# EAGLE design PCB1M1A2 (EAGLE 6.2)
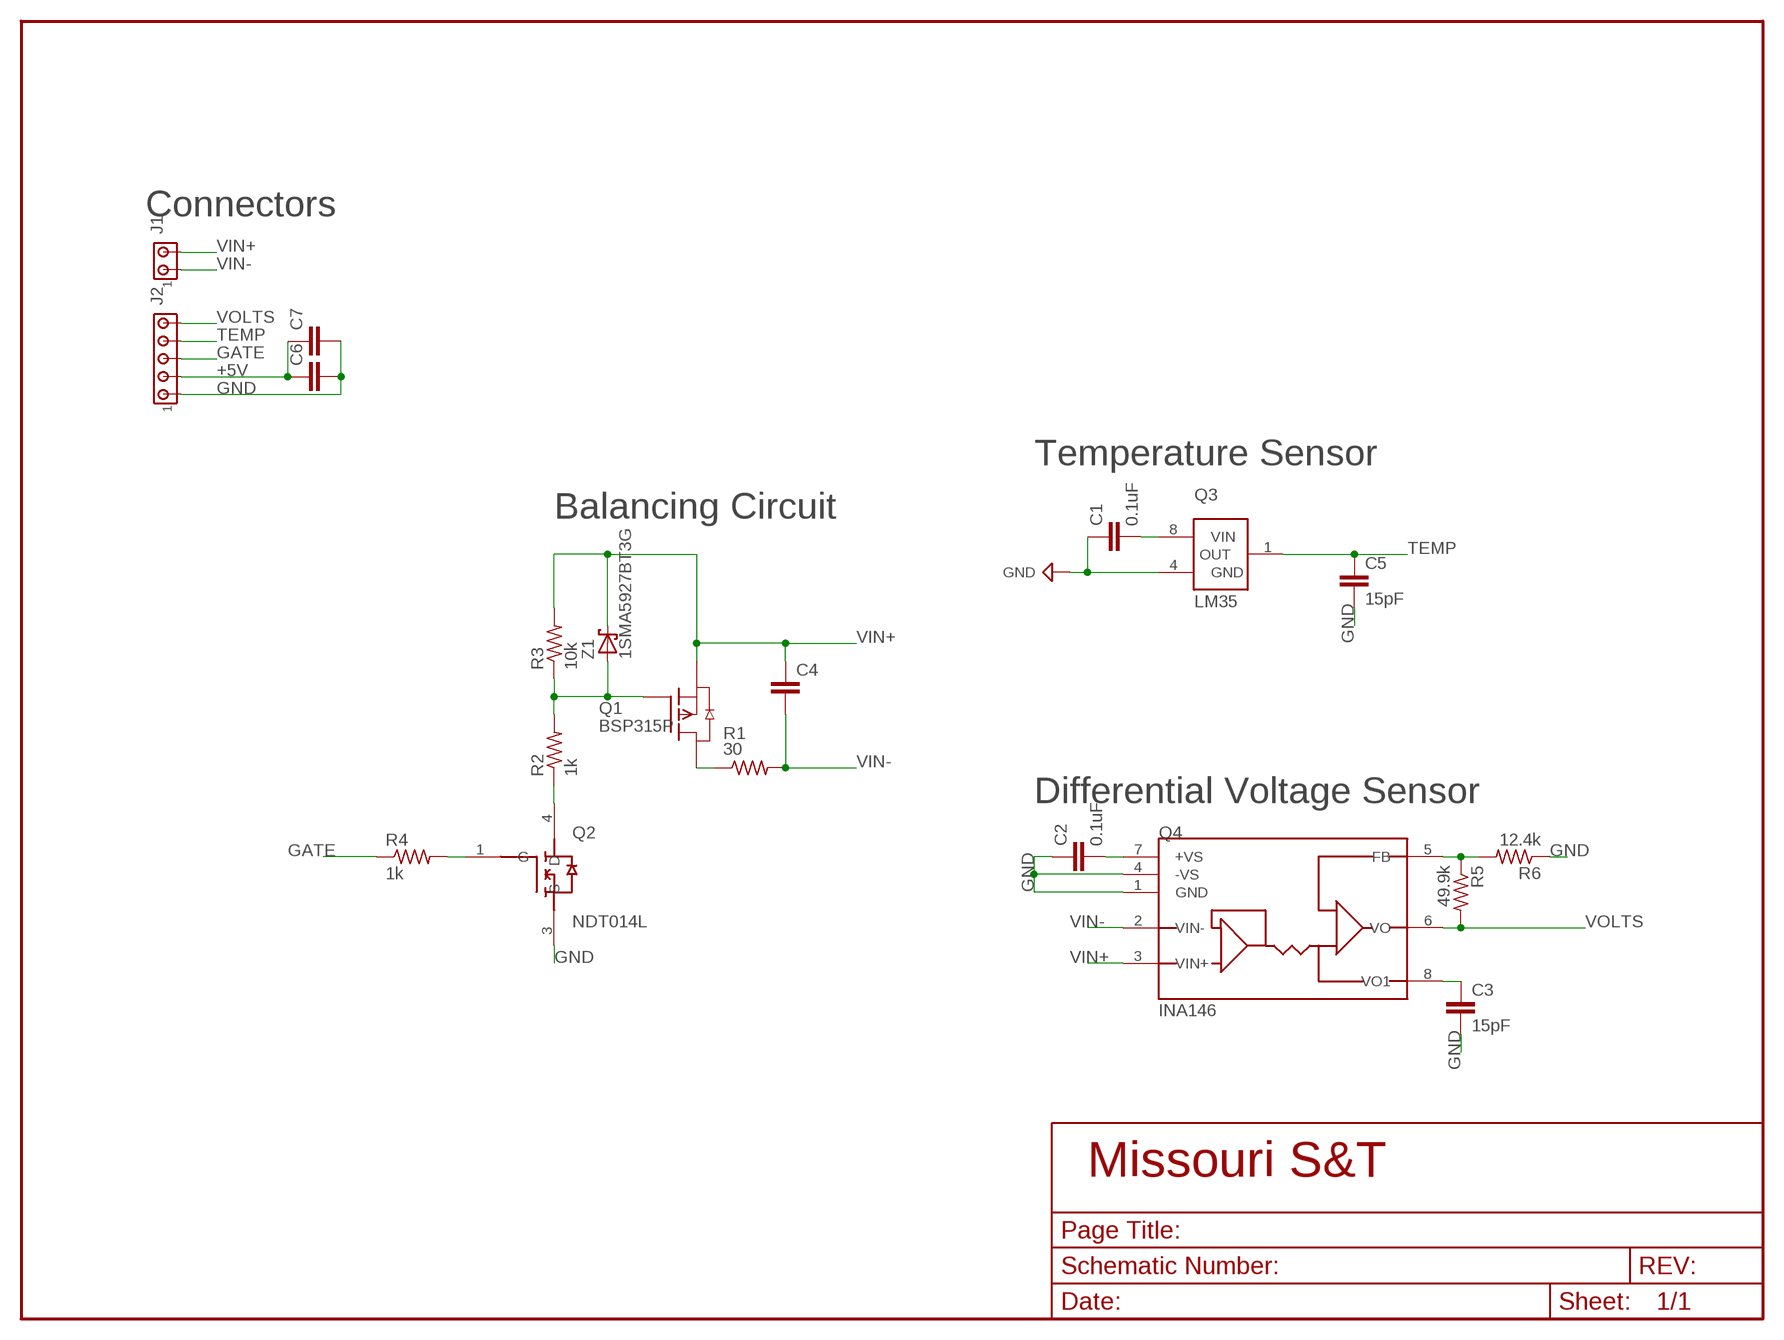
[diagram p0: schematic, sheet 1]

## Parts
C1  0.1uF  C_CAP_1206  [C_1206]
C2  0.1uF  C_CAP_1206  [C_1206]
C3  15pF  C_CAP_1206  [C_1206]
C4  C_CAP_1206  [C_1206]
C5  15pF  C_CAP_1206  [C_1206]
C6  C_CAP_1206  [C_1206]
C7  C_CAP_1206  [C_1206]
J1  J_MTA2P_100  [J_MTA100_2P]
J2  J_MTA5P_100  [J_MTA100_5P]
Q1  BSP315P  Q_BSP315P  [SOT-223]
Q2  NDT014L  Q_NDT014L  [SOT-223]
Q3  LM35  Q_LM35SOIC8  [SOIC8]
Q4  INA146  Q_INA146  [SOIC8]
R1  30  R_2512  [R_2512]
R2  1k  R_RES_1206  [R_1206]
R3  10k  R_RES_1206  [R_1206]
R4  1k  R_RES_1206  [R_1206]
R5  49.9k  R_RES_1206  [R_1206]
R6  12.4k  R_RES_1206  [R_1206]
Z1  1SMA5927BT3G  D_SSA34-E3/61T  [D_DO214AC]

## Nets
+5V: C1.2 C2.2 C6.1 C7.1 J2.2 Q3.8(VIN) Q4.7(+VS)
GATE: J2.3 R4.1
GND: C1.1 C2.1 C3.2 C5.2 C6.2 C7.2 J2.1 Q2.3(S) Q3.4(GND) Q4.1(GND) Q4.4(-VS) R6.1 ; supply symbol labelled SUP_GND
N$1: Q1.2(D) R1.P$1
N$7: Q2.4(D) R2.1
N$9: Q2.1(G) R4.2
N$13: Q4.5(FB) R5.1 R6.2
N$14: C3.1 Q4.8(VO1)
TEMP: C5.1 J2.4 Q3.1(OUT)
VIN+: C4.1 J1.2 Q1.3(S) Q4.3(VIN+) R3.2 Z1.C
VIN-: C4.2 J1.1 Q4.2(VIN-) R1.P$2
VOLTS: J2.5 Q4.6(VO) R5.2
Z1: Q1.1(G) R2.2 R3.1 Z1.A

## Notes on the sheet
- Connectors
- Temperature Sensor
- Balancing Circuit
- Differential Voltage Sensor

## Library data of the parts
C1-C7 = Lib_Passive:C_CAP
J1 = Lib_TH:J_MTA2P
J2 = Lib_TH:J_MTA5P
Q1 = PCB0M1:Q_BSP315P
Q2 = PCB0M1:Q_NDT014L
Q3 = PCB0M1:Q_LM35: IC, TEMPERATURE SENSOR, 0.4°C, TO-92-3
Q4 = PCB0M1:Q_INA146: High Voltage Differential Amplifier
R1 = PCB0M1:R_2512
R2-R6 = Lib_Passive:R_RES
Z1 = EE371:D_SSA34-E3/61T: SCHOTTKY RECTIFIER, 3A 40V DO-214AC

## Board
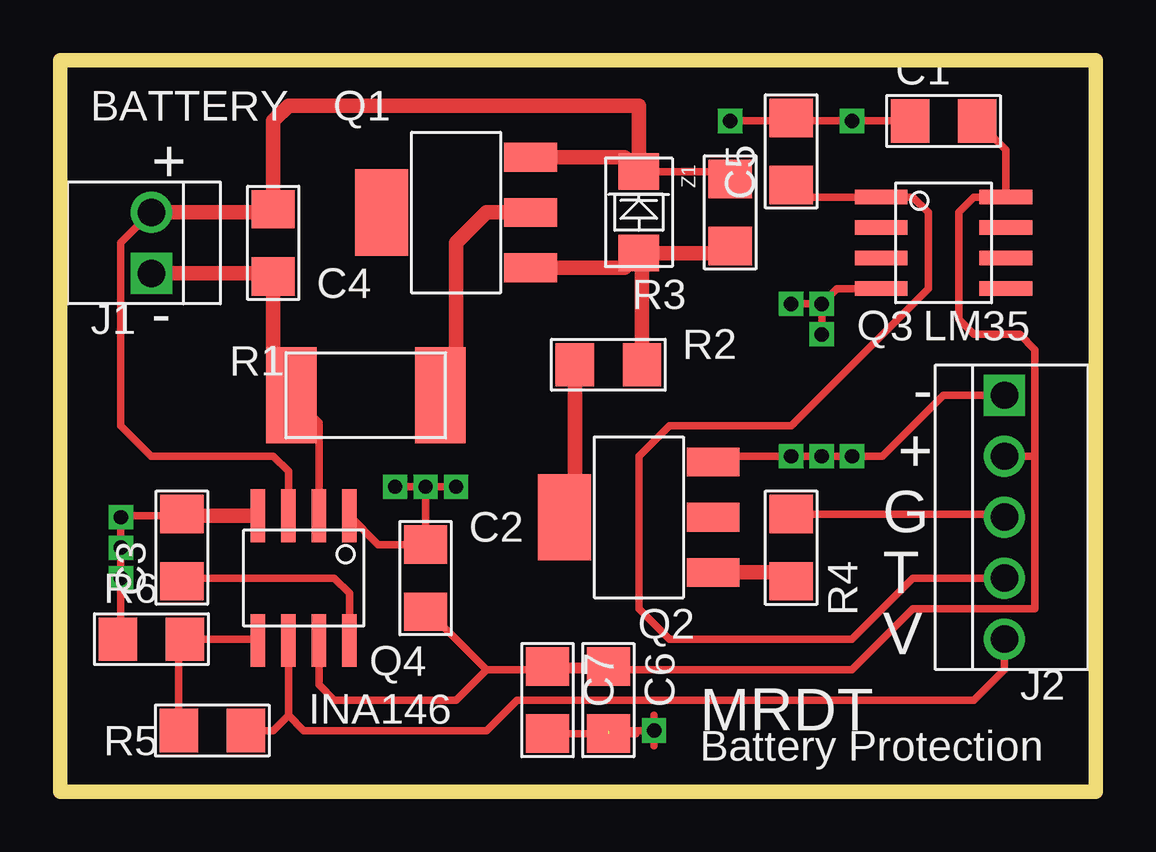
[diagram p1: board, top side]
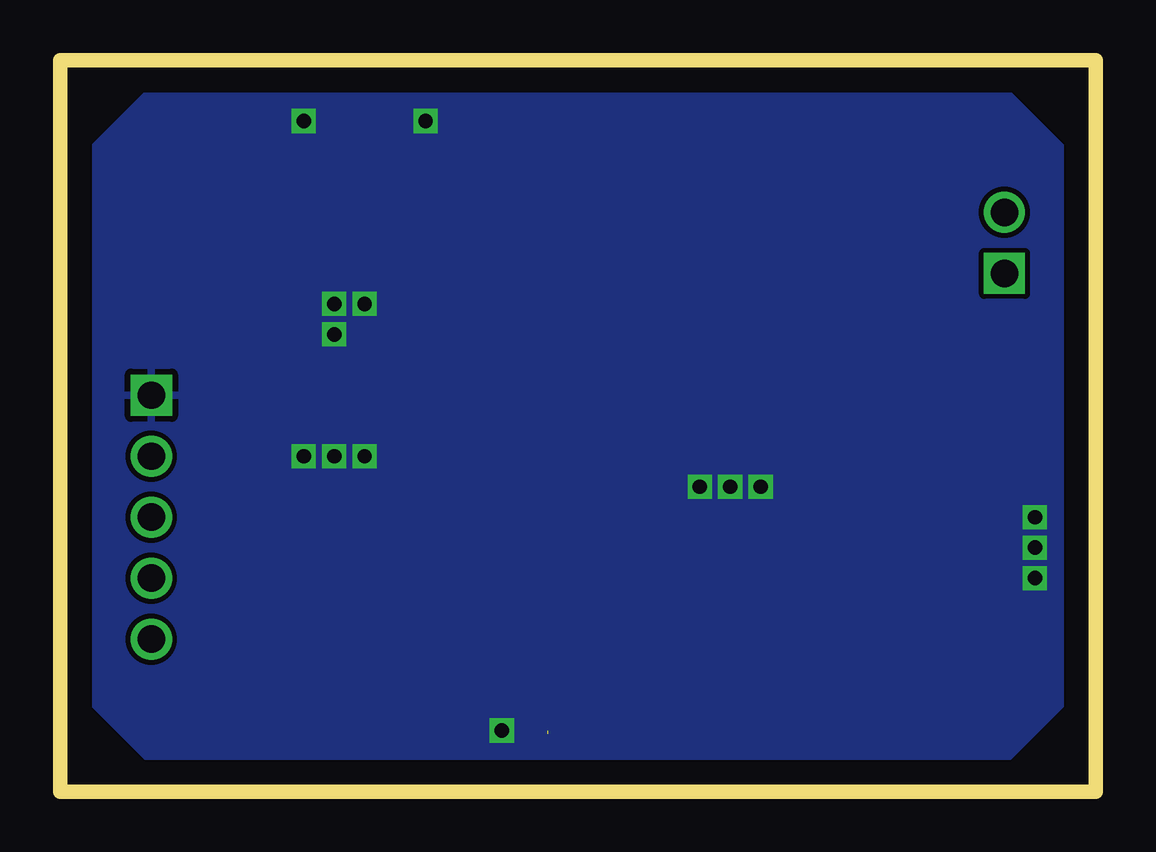
[diagram p2: board, bottom side, seen from below]

Size 43.18 x 30.48 mm. Coordinates in mm from the lower left corner, seen from the top.
Outline: 0,0 0,30.48 43.18,30.48 43.18,0 0,0
Copper layers (1*16): Top 0.035mm / dielectric 1.5mm / Bottom 0.035mm
Design rules: minimum track width 10mil, minimum drill 20mil, track to track 8mil, track to pad 8mil, pad to pad 8mil, via to via 8mil, smd to smd 8mil, copper to edge 40mil, drill to drill 8mil, minimum pad ring 10mil, minimum via ring 8mil, stop-mask expansion 4mil, vias tented up to drill 0mil, thermal gap 10mil

### Footprints (pad centres in the part's own frame; a part is rotated, then mirrored left to right if it is on the bottom)
C_1206 = smd 1.6 x 1.8: 1 -1.4,0; 2 1.4,0
J_MTA100_2P = drill 1.143 square: 1 1.27,0 | drill 1.143: 2 -1.27,0
J_MTA100_5P = drill 1.143 square: 1 5.08,0 | drill 1.143: 2 2.54,0; 3 0,0; 4 -2.54,0; 5 -5.08,0
SOT-223 = smd 1.2 x 2.2: 1 -2.3,-3.1; 2 0,-3.1; 3 2.3,-3.1 | smd 3.6 x 2.2: 4 0,3.1
SOIC8 = smd 2.2 x 0.6: 1 -2.6,1.905; 2 -2.6,0.635; 3 -2.6,-0.635; 4 -2.6,-1.905; 5 2.6,-1.905; 6 2.6,-0.635; 7 2.6,0.635; 8 2.6,1.905
R_2512 = smd 2.1 x 4: P$1 -3.15,0; P$2 3.05,0
R_1206 = smd 1.6 x 1.8: 1 -1.4,0; 2 1.4,0
D_DO214AC = smd 1.52 x 1.68: A 1.7,0; C -1.7,0

### Placement (x,y rotation side)
C1  36.83,27.94 0 top
C2  15.24,8.89 270 top
C3  5.08,10.16 90 top
C4  8.89,22.86 270 top
C5  30.48,26.67 90 top
C6  22.86,3.81 270 top
C7  20.32,3.81 270 top
J1  3.81,22.86 270 top
J2  39.37,11.43 90 top
Q1  16.51,24.13 90 top
Q2  24.13,11.43 90 top
Q3  36.83,22.86 0 top
Q4  10.16,8.89 270 top
R1  12.7,16.51 180 top
R2  22.86,17.78 0 top
R3  27.94,24.13 90 top
R4  30.48,10.16 270 top
R5  6.35,2.54 0 top
R6  3.81,6.35 0 top
Z1  24.13,24.13 270 top

### Tracks (layer width: path | path; a pad name or v marks a point on that pad's centre or on a via)
+5V
  Top 0.305: Q4.7 10.79,4.45 11.43,3.81 16.51,3.81 17.78,5.08 | C1.2 39.43,26.74 Q3.8 38.1,24.77 37.47,24.13 37.47,19.68 38.1,19.05 40.01,19.05 40.64,18.41 40.64,13.97 | J2.2 40.64,13.97 | 40.64,13.97 40.64,7.62 35.56,7.62 33.02,5.08 22.86,5.08 | 22.86,5.08 17.78,5.08 | 17.78,5.08 15.37,7.49 C2.2 | 22.86,5.08 C6.1 C7.1
GATE
  Top 0.305: R4.1 39.24,11.56 J2.3
GND  (via drill 0.6)  (1 unrouted)
  Top 0.305: Q4.1 13.27,10.29 C2.1 v15.24,12.7 | 5.15,11.49 2.6,11.49 v2.54,11.43 v2.54,10.16 v2.54,8.89 2.54,6.48 R6.1 | C1.1 v33.02,27.94 30.61,27.94 | 30.61,27.94 C5.2 | v15.24,12.7 v16.51,12.7 | v15.24,12.7 v13.97,12.7 | Q2.3 27.47,13.97 v30.48,13.97 v31.75,13.97 v33.02,13.97 34.29,13.97 36.83,16.51 J2.1 | 30.61,27.94 v27.94,27.94 | Q3.4 32.38,20.95 v31.75,20.32 | v30.48,20.32 v31.75,20.32 | v31.75,20.32 v31.75,19.05 | C6.2 C7.2 24,2.41 | v24.77,2.54 22.86,2.54 | v24.77,2.54 24.77,3.17 | v24.77,2.54 24.77,1.91
  Top 0.61: Q4.4 5.15,11.49 C3.2
  pour Bottom: 1.27,26.67 3.81,29.21 39.37,29.21 41.91,26.67 41.91,3.81 39.37,1.27 3.81,1.27 1.27,3.81
N$1
  Top 0.61: 16.51,17.17 R1.P$1 16.51,16.51 16.51,22.86 17.78,24.13 Q1.2
N$7
  Top 0.61: R2.1 21.46,11.86 Q2.4
N$9
  Top 0.61: Q2.1 30.11,9.13 R4.2
N$13
  Top 0.305: Q4.5 8.2,6.35 R6.2 4.95,6.09 R5.1
N$14
  Top 0.305: Q4.8 12.06,8.26 11.43,8.89 5.21,8.89 C3.1
TEMP
  Top 0.305: C5.1 30.98,24.77 Q3.1 35.56,24.77 36.2,24.13 36.2,20.95 30.48,15.24 25.4,15.24 24.13,13.97 24.13,7.62 25.4,6.35 33.02,6.35 35.56,8.89 J2.4
VIN+
  Top 0.305: Q4.3 9.53,13.34 8.89,13.97 3.81,13.97 2.54,15.24 2.54,22.86 J1.2 | Z1.C 27.64,25.83 R3.2
  Top 0.61: J1.2 8.89,24.13 C4.1 8.89,27.94 9.53,28.57 24.13,28.57 Z1.C 23.53,26.43 Q1.3
VIN-
  Top 0.305: Q4.2 10.79,15.37 R1.P$2
  Top 0.61: J1.1 8.89,21.59 C4.2 8.89,16.51 R1.P$2
VOLTS
  Top 0.305: Q4.6 9.53,3.17 | 9.53,3.17 8.89,2.54 R5.2 | 9.53,3.17 10.16,2.54 17.78,2.54 19.05,3.81 38.1,3.81 39.37,5.08 J2.5
Z1
  Top 0.61: Q1.1 23.53,21.83 Z1.A | Z1.A 27.64,22.43 R3.1 | R2.2 24.26,22.3 Z1.A

### Text on the board
tPlace: BATTERY | + | - | - | + | G | T | V | MRDT | Battery Protection
Drill_legend: Drill legend | Date: 2/2/2014 2:26:06 PM | 1.1430 mm / 45.000 mil count= 7 | 0.6000 mm / 23.622 mil count= 15